# EasyEDA schematic VintagePhone.json
TITLE: Sheet_1; REV: 1.0; Date: 2023-03-29; Sheet: 1/1; Company: Pagano Electronics
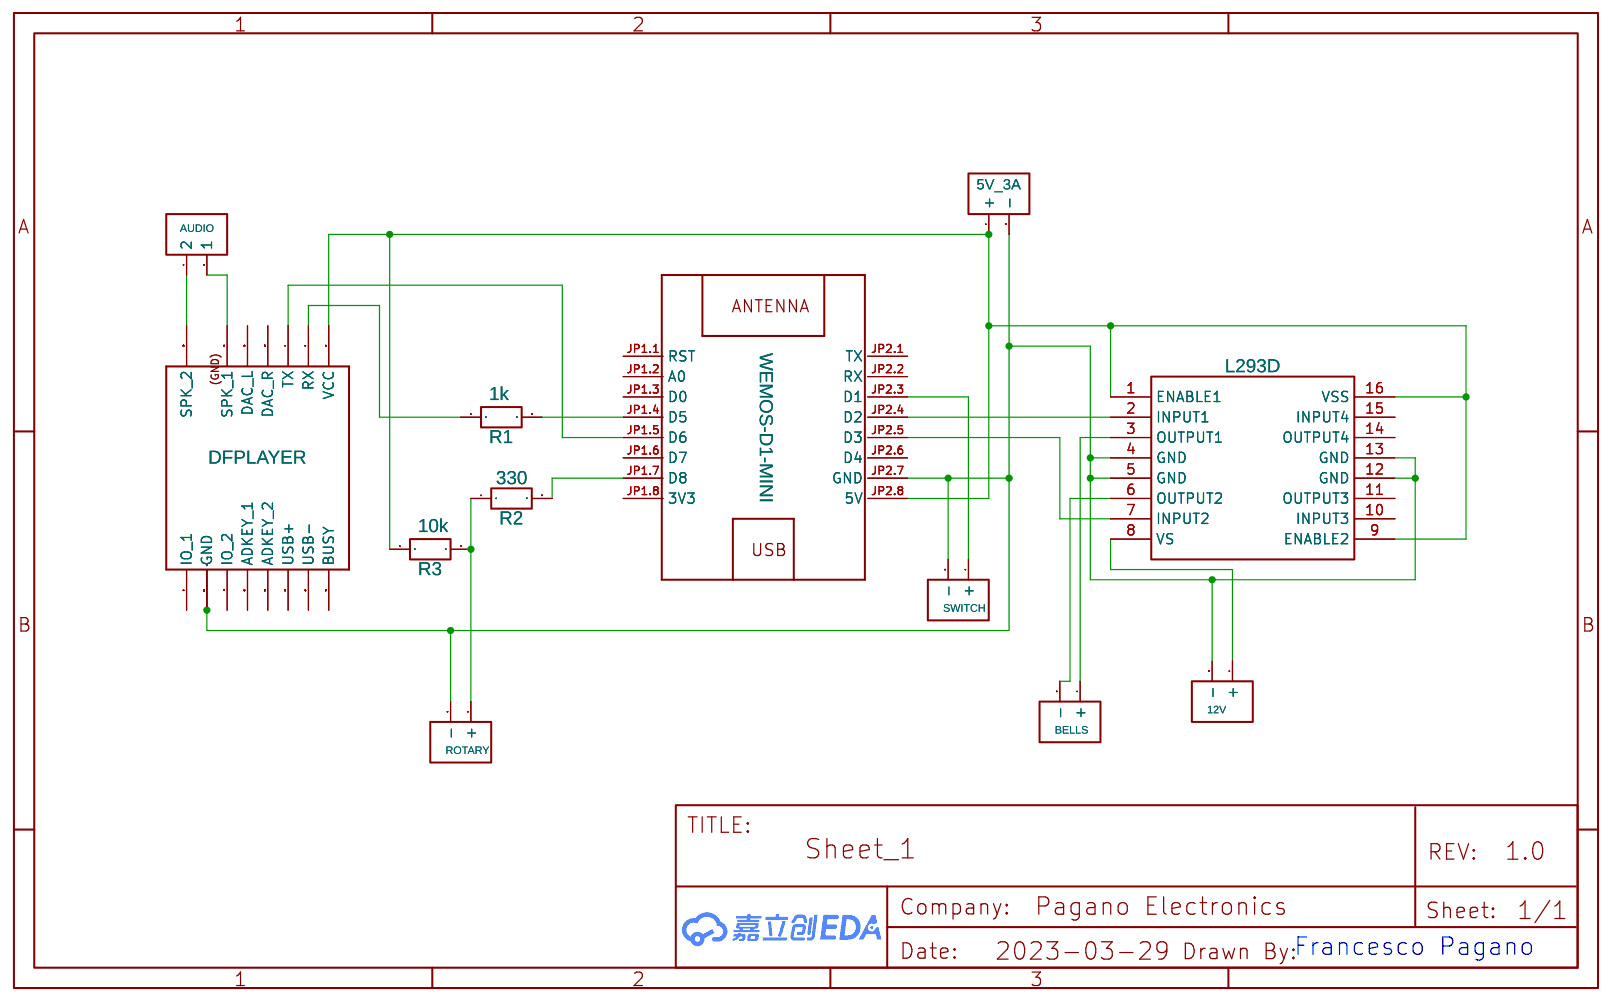
[diagram p0: schematic sheet]

## Parts
5V_3A  Alimentazione  [CONN-TH_2P-P5.00]
12V  Bells  [CONN-TH_2P-P5.00]
AUDIO  Audio  [CONN-TH_2P-P5.00]
BELLS  Bells  [CONN-TH_2P-P5.00]
DFPLAYER  DFPLAYER  [DFPLAYER]
L293D  L293D  [DIP-16_L20.0-W6.4-P2.54-LS7.6-BL]
R1  1k  [R_AXIAL-0.5]
R2  330  [R_AXIAL-0.5]
R3  10k  [R_AXIAL-0.5]
ROTARY  Rotary  [CONN-TH_2P-P5.00]
SWITCH  Switch  [CONN-TH_2P-P5.00]
WEMOS  WEMOS-D1-MINI  [WEMOS-D1-MINI]

## Library data of the parts
5V_3A 12V AUDIO BELLS ROTARY SWITCH = CONN-TH_2P-P5.00: Supplier: LCSC; Contributor: LCEDA_Lib
DFPLAYER = DFPLAYER: Contributor: iodev
L293D = L293D: Contributor: pitreluc; Supplier: LCSC; Manufacturer: ST(意法半导体); Supplier Part: C12340; JLCPCB Part Class: Extended Part
R1-R3 = R_AXIAL-0.5_EU: Contributor: LCEDA_Lib
WEMOS = WEMOS-D1-MINI: Contributor: Chilli

## Nets
Net-(5V_3A-1): 5V_3A.1(+) DFPLAYER.VCC L293D.1(ENABLE1) L293D.9(ENABLE2) L293D.16(VSS) R3.1 WEMOS.JP2.8(5V)
Net-(5V_3A-2): 5V_3A.2(-) 12V.2(-) DFPLAYER.GND_1(GND) DFPLAYER.GND_2(GND) L293D.4(GND) L293D.5(GND) L293D.12(GND) L293D.13(GND) ROTARY.2(-) SWITCH.2(-) WEMOS.JP2.7(GND)
Net-(12V-1): 12V.1(+) L293D.8(VS)
Net-(AUDIO-1): AUDIO.1(2) DFPLAYER.SPK2(SPK_2)
Net-(AUDIO-2): AUDIO.2(1) DFPLAYER.SPK1(SPK_1)
Net-(BELLS-1): BELLS.1(+) L293D.3(OUTPUT1)
Net-(BELLS-2): BELLS.2(-) L293D.6(OUTPUT2)
Net-(DFPLAYER-RX): DFPLAYER.RX R1.1
Net-(DFPLAYER-TX): DFPLAYER.TX WEMOS.JP1.5(D6)
Net-(L293D-2): L293D.2(INPUT1) WEMOS.JP2.4(D2)
Net-(L293D-7): L293D.7(INPUT2) WEMOS.JP2.5(D3)
Net-(R1-2): R1.2 WEMOS.JP1.4(D5)
Net-(R2-1): R2.1 R3.2 ROTARY.1(+)
Net-(R2-2): R2.2 WEMOS.JP1.7(D8)
Net-(SWITCH-1): SWITCH.1(+) WEMOS.JP2.3(D1)

Not connected (* = marked no-connect by the designer): DFPLAYER ADKEY1(ADKEY_1) ADKEY2(ADKEY_2) BUSY DAC_L DAC_R IO1(IO_1) IO2(IO_2) USB+ USB-; L293D 10(INPUT3) 11(OUTPUT3) 14(OUTPUT4) 15(INPUT4); WEMOS JP1.1(RST) JP1.2(A0) JP1.3(D0) JP1.6(D7) JP1.8(3V3) JP2.1(TX) JP2.2(RX) JP2.6(D4)

## Notes on the sheet
- Francesco Pagano
